# Altium schematic sheet Buck Converter.SchDoc
size A; SheetNumber: 2; SheetTotal: 3; SPICEModelCacheDMXYRHQF: <root> / <DocumentId>DMXYRHQF</DocumentId> / </root>
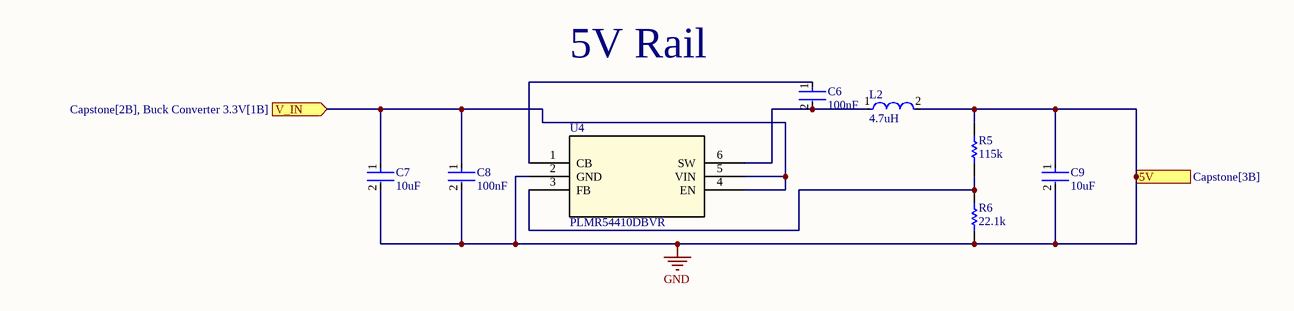
[diagram p0: Buck Converter.SchDoc]

## Parts
C6  100nF  [FP-C0805C-DN-MFG]
C7  10uF  [FP-C0805C-DN-MFG]
C8  100nF  [FP-C0805C-DN-MFG]
C9  10uF  [FP-C0805C-DN-MFG]
L2  4.7uH  [FP-LQM21PH_G0-IPC_C]
R5  115k  [RESC1608X55X25ML10T15]
R6  22.1k  [RESC1608X55X25ML10T15]
U4  PLMR54410DBVR  [U_SOT-23_TEX]

## Ports
5V (out, see Capstone[3B]), V_IN (in, see Capstone[2B], Buck Converter 3.3V[1B])

## Nets
GND: C7.2 C8.2 C9.1 C9.2 L2.2 R5.2 R6.1 U4.2(GND) ; port 5V
V_IN: C7.1 C8.1 U4.4(EN) U4.5(VIN) ; port V_IN
NetC6_1: C6.1 U4.1(CB)
NetC6_2: C6.2 L2.1 U4.6(SW)
NetR5_1: R5.1 R6.2 U4.3(FB)

## Notes on the sheet
- 5V Rail

## Library data of the parts
C6 C8 = CMP-1036-04552-2: CAP CER 0.22UF 50V X7R 0805; Manufacturer: KEMET; Manufacturer Part Number: C0805C224K5RACTU; Value: 10uF; Temperature Coefficient: 30ppm/°C; Material: Ceramic; Tolerance: 0.1; ComponentLink2URL: https://content.kemet.com/datasheets/KEM_C1003_C0G_SMD.pdf; Temperature Characteristic: X7R; Device Class L3: Ceramic Capacitors; Lead Free: Yes; Temperature: -55°C to +125°C; RoHS: TRUE; Capacitance: 10uF; Automotive: No; Octopart: https://octopart.com/c0805c224k5ractu-kemet-144670; Temperature Range Low: -55°C; Height: 0.88mm; Device Class L1: Passive Components; Digikey Description: CAP CER 0.22UF 50V X7R 0805; ComponentLink2Description: Datasheet; Mouser Description: CAP CER 0.22UF 50V X7R 0805; Category: Cap; Ipc Land Pattern Name: CAPC200125X78; Temperature Range High: +125°C; Package: C0805C-DN; Device Class L2: Capacitors; Voltage Rating: 50 V
C7 C9 = CMP-1036-04552-2: CAP CER 0.22UF 50V X7R 0805; Manufacturer: KEMET; Manufacturer Part Number: C0805C224K5RACTU; Temperature Coefficient: 30ppm/°C; Material: Ceramic; Tolerance: 0.1; ComponentLink2URL: https://content.kemet.com/datasheets/KEM_C1003_C0G_SMD.pdf; Value: 10uF; Temperature Characteristic: X7R; Device Class L3: Ceramic Capacitors; Lead Free: Yes; Temperature: -55°C to +125°C; RoHS: TRUE; Capacitance: 10uF; Automotive: No; Octopart: https://octopart.com/c0805c224k5ractu-kemet-144670; Temperature Range Low: -55°C; Height: 0.88mm; Device Class L1: Passive Components; Digikey Description: CAP CER 0.22UF 50V X7R 0805; ComponentLink2Description: Datasheet; Mouser Description: CAP CER 0.22UF 50V X7R 0805; Category: Cap; Ipc Land Pattern Name: CAPC200125X78; Temperature Range High: +125°C; Package: C0805C-DN; Device Class L2: Capacitors; Voltage Rating: 50 V
L2 = CMP-06042-017025-1: Multilayer Type Inductor for Power Lines, 0805 (2012), 4.7μH, 20%, 0.288Ω, 0.8A; Core Material: Ferrite; Self Resonant Frequency: 30MHz; DC Resistance (DCR): 288mR; Test Frequency: 1MHz; Shielding: Shielded; Current Rating: 800mA; Mount: Surface Mount; Package Quantity: 4000; Case/Package: 0805; Length: 0.079inch; Packaging: Cut Tape; Height - Seated (Max): 0.039inch; Case Code (Metric): 2012; Case Code (Imperial): 0805; Width: 0.049inch; Max Operating Temperature: 125°C; RoHS Compliant: Yes; Tolerance: 20%; Min Operating Temperature: -55°C; Inductance: 4.7uH
R5 R6 = CMP-2100-03667-1: Chip Resistor, 0 Ohm, +/- 5%, 0.1 W, -55 to 155 degC, 0603 (1608 Metric), RoHS, Tape and Reel; Manufacturer: Yageo; Temperature Coefficient: 200ppm/degreesC; Voltage Rating: 50V; Power Rating: 100mW; Resistance: 0mOhm; Width: 0.8mm; Max Operating Temperature: 155degC; Tolerance: 5%; Package Reference: 0603; Height: 0.45mm; Depth: 0.8mm; Package Description: 2-Pin Surface Mount Device, Body 1.6 x 0.8 mm; Termination: SMD/SMT; Package Quantity: 5000; Case/Package: 0603; Case Code (Imperial): 0603; Radiation Hardening: No; Number of Pins: 2; Length: 1.6mm; Lead Free: LeadFree; Voltage Rating (DC): 50V; Military Standard: Not; Datasheet URL: http://www.yageo.com/NewPortal/yageodocoutput?fileName=/pdf/R-Chip/PYu-RC_Group_51_RoHS_L_5.pdf; Manufacturer URL: http://www.yageo.com/; Packaging: TapeandReel; Case Code (Metric): 1608; Min Operating Temperature: -55degC; Composition: ThickFilm; RoHSCompliant: true; Contact Plating: Tin; Datasheet Version: Rev. 5, 10/2016; REACH SVHC: NoSVHC
U4 = PLMR54410DBVR: No Description Available; Mfr_Name: Texas Instruments; RefDes: RefDes; Type: Type